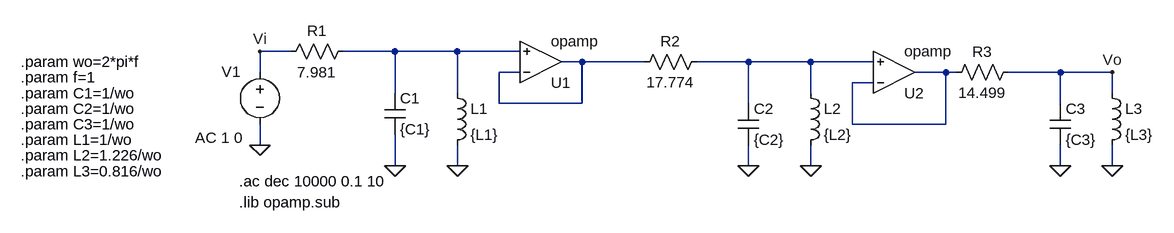
[diagram p0: schematic LPBpasivo.asc]
LPBpasivo.asc, the LTspice schematic file:
Version 4
SHEET 1 1368 680
WIRE 16 112 -32 112
WIRE 176 112 96 112
WIRE 272 112 176 112
WIRE 368 112 272 112
WIRE 464 128 432 128
WIRE 560 128 464 128
WIRE 720 128 640 128
WIRE 816 128 720 128
WIRE 912 128 816 128
WIRE -32 144 -32 112
WIRE 368 144 336 144
WIRE 1024 144 976 144
WIRE 1040 144 1024 144
WIRE 1200 144 1120 144
WIRE 1280 144 1200 144
WIRE 912 160 880 160
WIRE 176 176 176 112
WIRE 272 176 272 112
WIRE 816 176 816 128
WIRE 1280 176 1280 144
WIRE 336 192 336 144
WIRE 464 192 464 128
WIRE 464 192 336 192
WIRE 720 192 720 128
WIRE 1200 192 1200 144
WIRE 880 224 880 160
WIRE 1024 224 1024 144
WIRE 1024 224 880 224
WIRE -32 256 -32 224
WIRE 176 288 176 240
WIRE 272 288 272 256
WIRE 720 288 720 256
WIRE 816 288 816 256
WIRE 1200 288 1200 256
WIRE 1280 288 1280 256
FLAG 176 288 0
FLAG 272 288 0
FLAG 720 288 0
FLAG 816 288 0
FLAG 1200 288 0
FLAG 1280 288 0
FLAG -32 256 0
FLAG -32 112 Vi
FLAG 1280 144 Vo
SYMBOL res 112 96 R90
WINDOW 0 0 56 VBottom 2
WINDOW 3 32 56 VTop 2
SYMATTR InstName R1
SYMATTR Value 7.981
SYMBOL res 656 112 R90
WINDOW 0 0 56 VBottom 2
WINDOW 3 32 56 VTop 2
SYMATTR InstName R2
SYMATTR Value 17.774
SYMBOL res 1136 128 R90
WINDOW 0 0 56 VBottom 2
WINDOW 3 32 56 VTop 2
SYMATTR InstName R3
SYMATTR Value 14.499
SYMBOL cap 160 176 R0
SYMATTR InstName C1
SYMATTR Value {C1}
SYMBOL ind 256 160 R0
SYMATTR InstName L1
SYMATTR Value {L1}
SYMBOL ind 800 160 R0
SYMATTR InstName L2
SYMATTR Value {L2}
SYMBOL ind 1264 160 R0
SYMATTR InstName L3
SYMATTR Value {L3}
SYMBOL cap 704 192 R0
SYMATTR InstName C2
SYMATTR Value {C2}
SYMBOL cap 1184 192 R0
SYMATTR InstName C3
SYMATTR Value {C3}
SYMBOL OpAmps\\opamp 400 192 M180
SYMATTR InstName U1
SYMBOL OpAmps\\opamp 944 208 M180
SYMATTR InstName U2
SYMBOL voltage -32 128 R0
WINDOW 0 -59 15 Left 2
WINDOW 123 -100 117 Left 2
WINDOW 39 0 0 Left 0
SYMATTR InstName V1
SYMATTR Value2 AC 1 0
SYMATTR Value ""
TEXT -64 312 Left 2 !.ac dec 10000 0.1 10
TEXT -64 344 Left 2 !.lib opamp.sub
TEXT -400 152 Left 2 !.param f=1
TEXT -400 176 Left 2 !.param C1=1/wo
TEXT -400 200 Left 2 !.param C2=1/wo
TEXT -400 224 Left 2 !.param C3=1/wo
TEXT -400 248 Left 2 !.param L1=1/wo
TEXT -400 272 Left 2 !.param L2=1.226/wo
TEXT -400 128 Left 2 !.param wo=2*pi*f
TEXT -400 296 Left 2 !.param L3=0.816/wo

The netlist it stands for:
* LPBpasivo.asc
R1 N001 Vi 7.981
R2 N003 N002 17.774
R3 Vo N004 14.499
C1 N001 0 {C1}
L1 N001 0 {L1}
L2 N003 0 {L2}
L3 Vo 0 {L3}
C2 N003 0 {C2}
C3 Vo 0 {C3}
XU1 N002 N001 N002 opamp Aol=100K GBW=10Meg  ; pins invin noninvin out
XU2 N004 N003 N004 opamp Aol=100K GBW=10Meg  ; pins invin noninvin out
V1 Vi 0 AC 1 0
.ac dec 10000 0.1 10
.lib opamp.sub
.param f=1
.param C1=1/wo
.param C2=1/wo
.param C3=1/wo
.param L1=1/wo
.param L2=1.226/wo
.param wo=2*pi*f
.param L3=0.816/wo
.backanno
.end